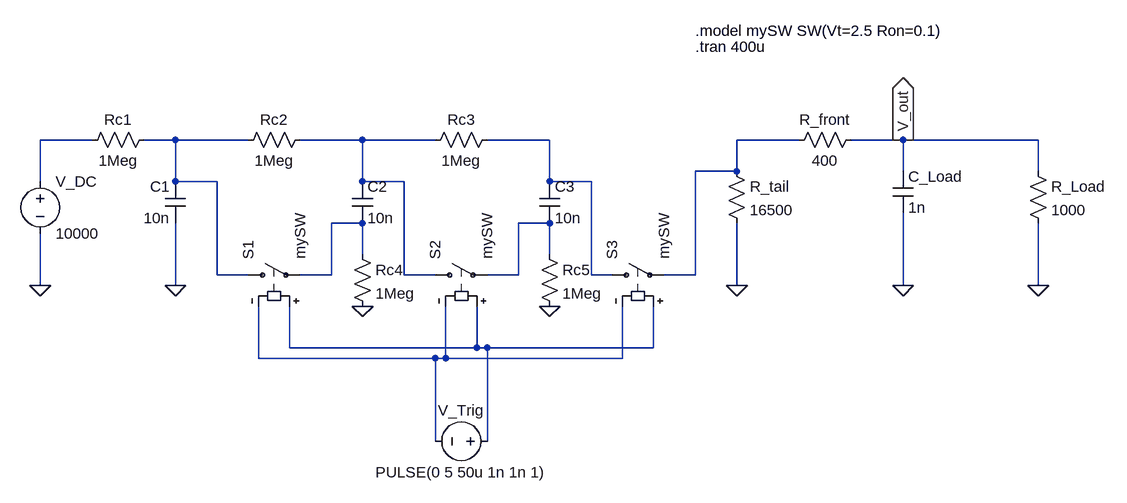
[diagram p0: schematic marx_generator_3stage.asc]
marx_generator_3stage.asc, the LTspice schematic file:
Version 4.1
SHEET 1 2052 680
WIRE 176 80 96 80
WIRE 304 80 256 80
WIRE 416 80 304 80
WIRE 592 80 496 80
WIRE 704 80 592 80
WIRE 880 80 784 80
WIRE 1264 80 1168 80
WIRE 1424 80 1344 80
WIRE 1632 80 1424 80
WIRE 1168 128 1168 80
WIRE 1168 128 1104 128
WIRE 1424 128 1424 80
WIRE 1632 128 1632 80
WIRE 96 144 96 80
WIRE 304 144 304 80
WIRE 368 144 304 144
WIRE 592 144 592 80
WIRE 656 144 592 144
WIRE 880 144 880 80
WIRE 944 144 880 144
WIRE 592 208 544 208
WIRE 880 208 832 208
WIRE 592 256 592 208
WIRE 880 256 880 208
WIRE 368 288 368 144
WIRE 416 288 368 288
WIRE 544 288 544 208
WIRE 544 288 496 288
WIRE 656 288 656 144
WIRE 704 288 656 288
WIRE 832 288 832 208
WIRE 832 288 784 288
WIRE 944 288 944 144
WIRE 976 288 944 288
WIRE 1104 288 1104 128
WIRE 1104 288 1056 288
WIRE 96 304 96 224
WIRE 304 304 304 208
WIRE 1168 304 1168 208
WIRE 1424 304 1424 192
WIRE 1632 304 1632 208
WIRE 480 400 480 336
WIRE 768 400 768 336
WIRE 768 400 480 400
WIRE 784 400 768 400
WIRE 1040 400 1040 336
WIRE 1040 400 784 400
WIRE 432 416 432 336
WIRE 704 416 432 416
WIRE 720 416 720 336
WIRE 720 416 704 416
WIRE 992 416 992 336
WIRE 992 416 720 416
WIRE 704 544 704 416
WIRE 784 544 784 400
FLAG 1424 304 0
FLAG 1168 304 0
FLAG 304 304 0
FLAG 96 304 0
FLAG 880 336 0
FLAG 592 336 0
FLAG 1632 304 0
FLAG 1424 80 V_out
IOPIN 1424 80 Out
SYMBOL res 272 64 R90
WINDOW 0 0 56 VBottom 2
WINDOW 3 32 56 VTop 2
SYMATTR InstName Rc1
SYMATTR Value 1Meg
SYMBOL cap 320 208 R180
WINDOW 0 24 56 Left 2
WINDOW 3 24 8 Left 2
SYMATTR InstName C1
SYMATTR Value 10n
SYMBOL voltage 96 128 R0
WINDOW 123 0 0 Left 0
WINDOW 39 0 0 Left 0
SYMATTR InstName V_DC
SYMATTR Value 10000
SYMBOL sw 400 288 R270
SYMATTR InstName S1
SYMATTR Value mySW
SYMBOL voltage 800 544 R90
WINDOW 0 -32 56 VBottom 2
WINDOW 3 32 56 VTop 2
WINDOW 123 0 0 Left 0
WINDOW 39 0 0 Left 0
SYMATTR InstName V_Trig
SYMATTR Value PULSE(0 5 50u 1n 1n 1)
SYMBOL res 1152 112 R0
SYMATTR InstName R_tail
SYMATTR Value 16500
SYMBOL res 1360 64 R90
WINDOW 0 0 56 VBottom 2
WINDOW 3 32 56 VTop 2
SYMATTR InstName R_front
SYMATTR Value 400
SYMBOL cap 1408 128 R0
SYMATTR InstName C_Load
SYMATTR Value 1n
SYMBOL cap 576 144 R0
SYMATTR InstName C2
SYMATTR Value 10n
SYMBOL cap 864 144 R0
SYMATTR InstName C3
SYMATTR Value 10n
SYMBOL sw 688 288 R270
SYMATTR InstName S2
SYMATTR Value mySW
SYMBOL sw 960 288 R270
SYMATTR InstName S3
SYMATTR Value mySW
SYMBOL res 512 64 R90
WINDOW 0 0 56 VBottom 2
WINDOW 3 32 56 VTop 2
SYMATTR InstName Rc2
SYMATTR Value 1Meg
SYMBOL res 800 64 R90
WINDOW 0 0 56 VBottom 2
WINDOW 3 32 56 VTop 2
SYMATTR InstName Rc3
SYMATTR Value 1Meg
SYMBOL res 576 240 R0
SYMATTR InstName Rc4
SYMATTR Value 1Meg
SYMBOL res 864 240 R0
SYMATTR InstName Rc5
SYMATTR Value 1Meg
SYMBOL res 1616 112 R0
SYMATTR InstName R_Load
SYMATTR Value 1000
TEXT 1104 -88 Left 2 !.model mySW SW(Vt=2.5 Ron=0.1)
TEXT 1104 -64 Left 2 !.tran 400u

The netlist it stands for:
* marx_generator_3stage.asc
Rc1 N002 N001 1Meg
C1 0 N002 10n
V_DC N001 0 10000
S1 N002 N006 N008 N009 mySW
V_Trig N008 N009 PULSE(0 5 50u 1n 1n 1)
R_tail N005 0 16500
R_front V_out N005 400
C_Load V_out 0 1n
C2 N003 N006 10n
C3 N004 N007 10n
S2 N003 N007 N008 N009 mySW
S3 N004 N005 N008 N009 mySW
Rc2 N003 N002 1Meg
Rc3 N004 N003 1Meg
Rc4 N006 0 1Meg
Rc5 N007 0 1Meg
R_Load V_out 0 1000
.model mySW SW(Vt=2.5 Ron=0.1)
.tran 400u
.backanno
.end